# EAGLE schematic attiny85 (EAGLE 9.6.2)
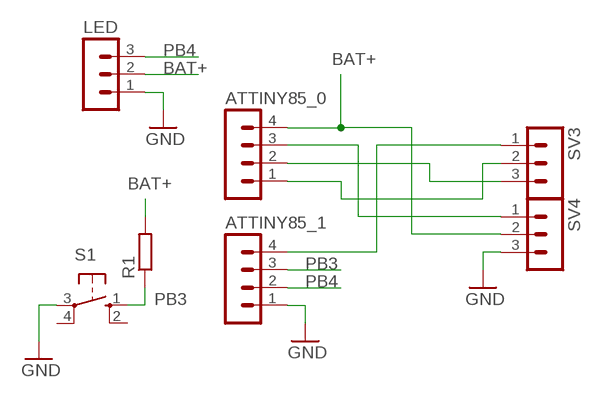
[diagram p0: schematic, sheet 1]

## Parts
ATTINY85_0  PINHEAD-MA04-1  [PINHEAD-MA04-1]
ATTINY85_1  PINHEAD-MA04-1  [PINHEAD-MA04-1]
LED  PINHEAD-MA03-1  [PINHEAD-MA03-1]
R1  R-EU_0204/5  [0204/5]
S1  10-XX  [B3F-10XX]
SV3  PINHEAD-MA03-1  [PINHEAD-MA03-1]
SV4  PINHEAD-MA03-1  [PINHEAD-MA03-1]

## Nets
BAT+: ATTINY85_0.4 LED.2 R1.2 SV4.2
GND: ATTINY85_1.1 LED.1 S1.3(P) SV4.3
N$1: ATTINY85_0.3 SV4.1
N$2: ATTINY85_1.4 SV3.1
N$3: ATTINY85_0.2 SV3.3
N$4: ATTINY85_0.1 SV3.2
PB3: ATTINY85_1.3 R1.1 S1.1(S)
PB4: ATTINY85_1.2 LED.3
Unconnected: S1.2(S1) S1.4(P1)

## Library data of the parts
ATTINY85_0 ATTINY85_1 = ytani1:PINHEAD-MA04-1: PIN HEADER; OC_FARNELL: unknown; OC_NEWARK: unknown
LED SV3 SV4 = ytani1:PINHEAD-MA03-1: PIN HEADER; OC_FARNELL: unknown; OC_NEWARK: unknown
R1 = rcl:R-EU_: RESISTOR, European symbol; SPICEPREFIX: R
S1 = switch-omron:10-XX: OMRON SWITCH; MPN: B3F-1000; OC_FARNELL: 176432; OC_NEWARK: 36M3542